# Altium schematic sheet 3_MCU.SchDoc
size A4; SheetNumber: 4; SheetTotal: 5
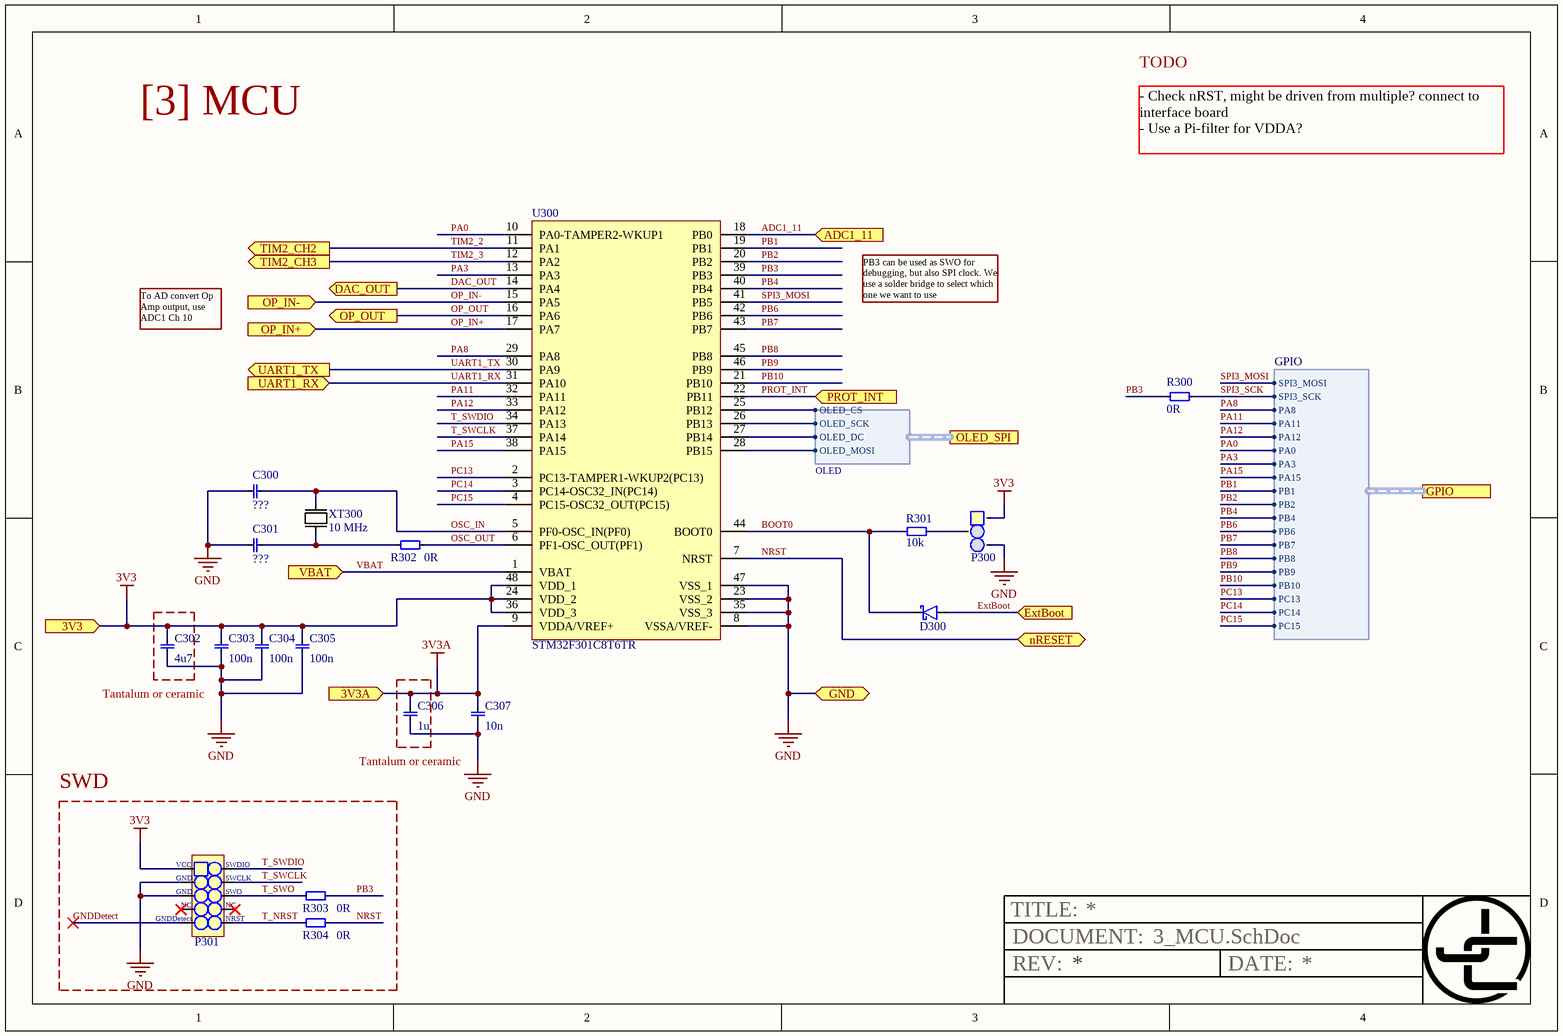
[diagram p0: 3_MCU.SchDoc]

## Parts
C300  value ???  [0805, cap]  (hidden comment: 0805, capacitor)
C301  value ???  [0805, cap]  (hidden comment: 0805, capacitor)
C302  value 4u7  [0805, cap]  (hidden comment: 0805, capacitor)
C303  value 100n  [0805, cap]  (hidden comment: 0805, capacitor)
C304  value 100n  [0805, cap]  (hidden comment: 0805, capacitor)
C305  value 100n  [0805, cap]  (hidden comment: 0805, capacitor)
C306  value 1u  [0805, cap]  (hidden comment: 0805, capacitor)
C307  value 10n  [0805, cap]  (hidden comment: 0805, capacitor)
D300  B340A  [DO-214AC]  (value not drawn)
P300  1x3 Pin Header Mux  [padThree_L]  (value not drawn)
P301  ARM 10 pin SWD  [FTSH-105-01-L-DV-K even odd]  (value not drawn)
R300  value 0R  [0603]  (hidden comment: 0603, resistor)
R301  value 10k  [0603]  (hidden comment: 0603, resistor)
R302  value 0R  [0603]  (hidden comment: 0603, resistor)
R303  value 0R  [0603]  (hidden comment: 0603, resistor)
R304  value 0R  [0603]  (hidden comment: 0603, resistor)
U300  STM32F301C8T6TR  [STM-LQFP48_L]
XT300  value 10 MHz  [XTAL_SMD_LP]  (hidden comment: XTAL ABM3)

## Ports
3V3 (in), 3V3A (in), ADC1_11 (in), DAC_OUT (out), ExtBoot (in), GND (bidir), GPIO (harness GPIO), nRESET (bidir), OLED_SPI (harness OLED), OP_IN+ (in), OP_IN- (in), OP_OUT (out), PROT_INT (in), TIM2_CH2 (out), TIM2_CH3 (out), UART1_RX (in), UART1_TX (out), VBAT (in)

## Harnesses
OLED: OLED_CS, OLED_SCK, OLED_DC, OLED_MOSI
GPIO: PB1, PB2, PB4, PB6, PB7, PB8, PB9, PB10, PC13, PC14, PC15, PA0, PA12, PA11, PA8, SPI3_SCK, SPI3_MOSI, PA3, PA15

## Nets
3V3: C302.1 C303.1 C304.1 C305.1 P300.1 P301.1(VCC) U300.24(VDD_2) U300.36(VDD_3) U300.48(VDD_1) ; port 3V3
3V3A: C306.1 C307.1 U300.9(VDDA/VREF+) ; port 3V3A
GND: C300.1 C301.1 C302.0 C303.0 C304.0 C305.0 C306.0 C307.0 P300.3 P301.3(GND) P301.5(GND) U300.8(VSSA/VREF-) U300.23(VSS_2) U300.35(VSS_3) U300.47(VSS_1) ; port GND
ADC1_11: U300.18(PB0) ; port ADC1_11
BOOT0: D300.1(K) R301.1 U300.44(BOOT0)
DAC_OUT: U300.14(PA4) ; port DAC_OUT
ExtBoot: D300.2(A) ; port ExtBoot
GNDDetect: P301.9(GNDDetect)
NRST: R304.0 U300.7(NRST) ; port nRESET
OP_IN+: U300.17(PA7) ; port OP_IN+
OP_IN-: U300.15(PA5) ; port OP_IN-
OP_OUT: U300.16(PA6) ; port OP_OUT
OSC_IN: C300.0 U300.5(PF0-OSC_IN(PF0)) XT300.2
OSC_OUT: R302.0 U300.6(PF1-OSC_OUT(PF1))
PA0: U300.10(PA0-TAMPER2-WKUP1) ; port GPIO.PA0
PA3: U300.13(PA3) ; port GPIO.PA3
PA8: U300.29(PA8) ; port GPIO.PA8
PA11: U300.32(PA11) ; port GPIO.PA11
PA12: U300.33(PA12) ; port GPIO.PA12
PA15: U300.38(PA15) ; port GPIO.PA15
PB1: U300.19(PB1) ; port GPIO.PB1
PB2: U300.20(PB2) ; port GPIO.PB2
PB3: R300.1 R303.0 U300.39(PB3)
PB4: U300.40(PB4) ; port GPIO.PB4
PB6: U300.42(PB6) ; port GPIO.PB6
PB7: U300.43(PB7) ; port GPIO.PB7
PB8: U300.45(PB8) ; port GPIO.PB8
PB9: U300.46(PB9) ; port GPIO.PB9
PB10: U300.21(PB10) ; port GPIO.PB10
PC13: U300.2(PC13-TAMPER1-WKUP2(PC13)) ; port GPIO.PC13
PC14: U300.3(PC14-OSC32_IN(PC14)) ; port GPIO.PC14
PC15: U300.4(PC15-OSC32_OUT(PC15)) ; port GPIO.PC15
PROT_INT: U300.22(PB11) ; port PROT_INT
SPI3_MOSI: U300.41(PB5) ; port GPIO.SPI3_MOSI
SPI3_SCK: R300.0 ; port GPIO.SPI3_SCK
T_NRST: P301.10(NRST) R304.1
T_SWCLK: P301.4(SWCLK) U300.37(PA14)
T_SWDIO: P301.2(SWDIO) U300.34(PA13)
T_SWO: P301.6(SWO) R303.1
TIM2_2: U300.11(PA1) ; port TIM2_CH2
TIM2_3: U300.12(PA2) ; port TIM2_CH3
UART1_RX: U300.31(PA10) ; port UART1_RX
UART1_TX: U300.30(PA9) ; port UART1_TX
VBAT: U300.1(VBAT) ; port VBAT
NetC301_0: C301.0 R302.1 XT300.1
NetP300_2: P300.2 R301.0
NetU300_25: U300.25(PB12) ; port OLED_SPI.OLED_CS
NetU300_26: U300.26(PB13) ; port OLED_SPI.OLED_SCK
NetU300_27: U300.27(PB14) ; port OLED_SPI.OLED_DC
NetU300_28: U300.28(PB15) ; port OLED_SPI.OLED_MOSI

Not connected (* = marked no-connect by the designer): P301 7(NC)* 8(NC)*

## Notes on the sheet
- [3] MCU
- TODO
- - Check nRST, might be driven from multiple? connect to interface board
  - Use a Pi-filter for VDDA?
- PB3 can be used as SWO for debugging, but also SPI clock. We use a solder bridge to select which one we want to use
- To AD convert Op Amp output, use ADC1 Ch 10
- Tantalum or ceramic
- SWD
- TITLE:
- REV:
- DOCUMENT:
- DATE:

## Library data of the parts
D300 = B340A-E3/61T: SchottkydiodE, 40 V, 3 A; Value: Schottky Diode; Farnell: 2335183
P300 = 1x3 Pin Header Mux: 2.54 mm; Value: 1x3 Pin Header
P301 = ARM 10 pin SWD: 1.27mm, PH; Value: 2x5 Pin Header, 2.54mm, Th; Digikey: FTSH-105-01-L-DV-K
U300 = STM32F301C8T6TR: MCU 32-bit ARM Cortex M4 RISC 64KB Flash 2.5V/3.3V 48-Pin LQFP T/R; Supplier 1: Mouser; Supplier Part Number 1: 511-STM32F301C8T6TR
XT300 = XTAL TXC 7A: 10 MHz, SMD, 5mm x 3,2mm, 30 ppm; Mf. nbr: ABM3-10.000MHZ-D2Y-T; CL: 18 pF; ESR: 60 R; C0: 7 pF (max); Farnell: 1841946